# EAGLE design H03 (EAGLE 6.6.0)

## Sheet 1 of 4
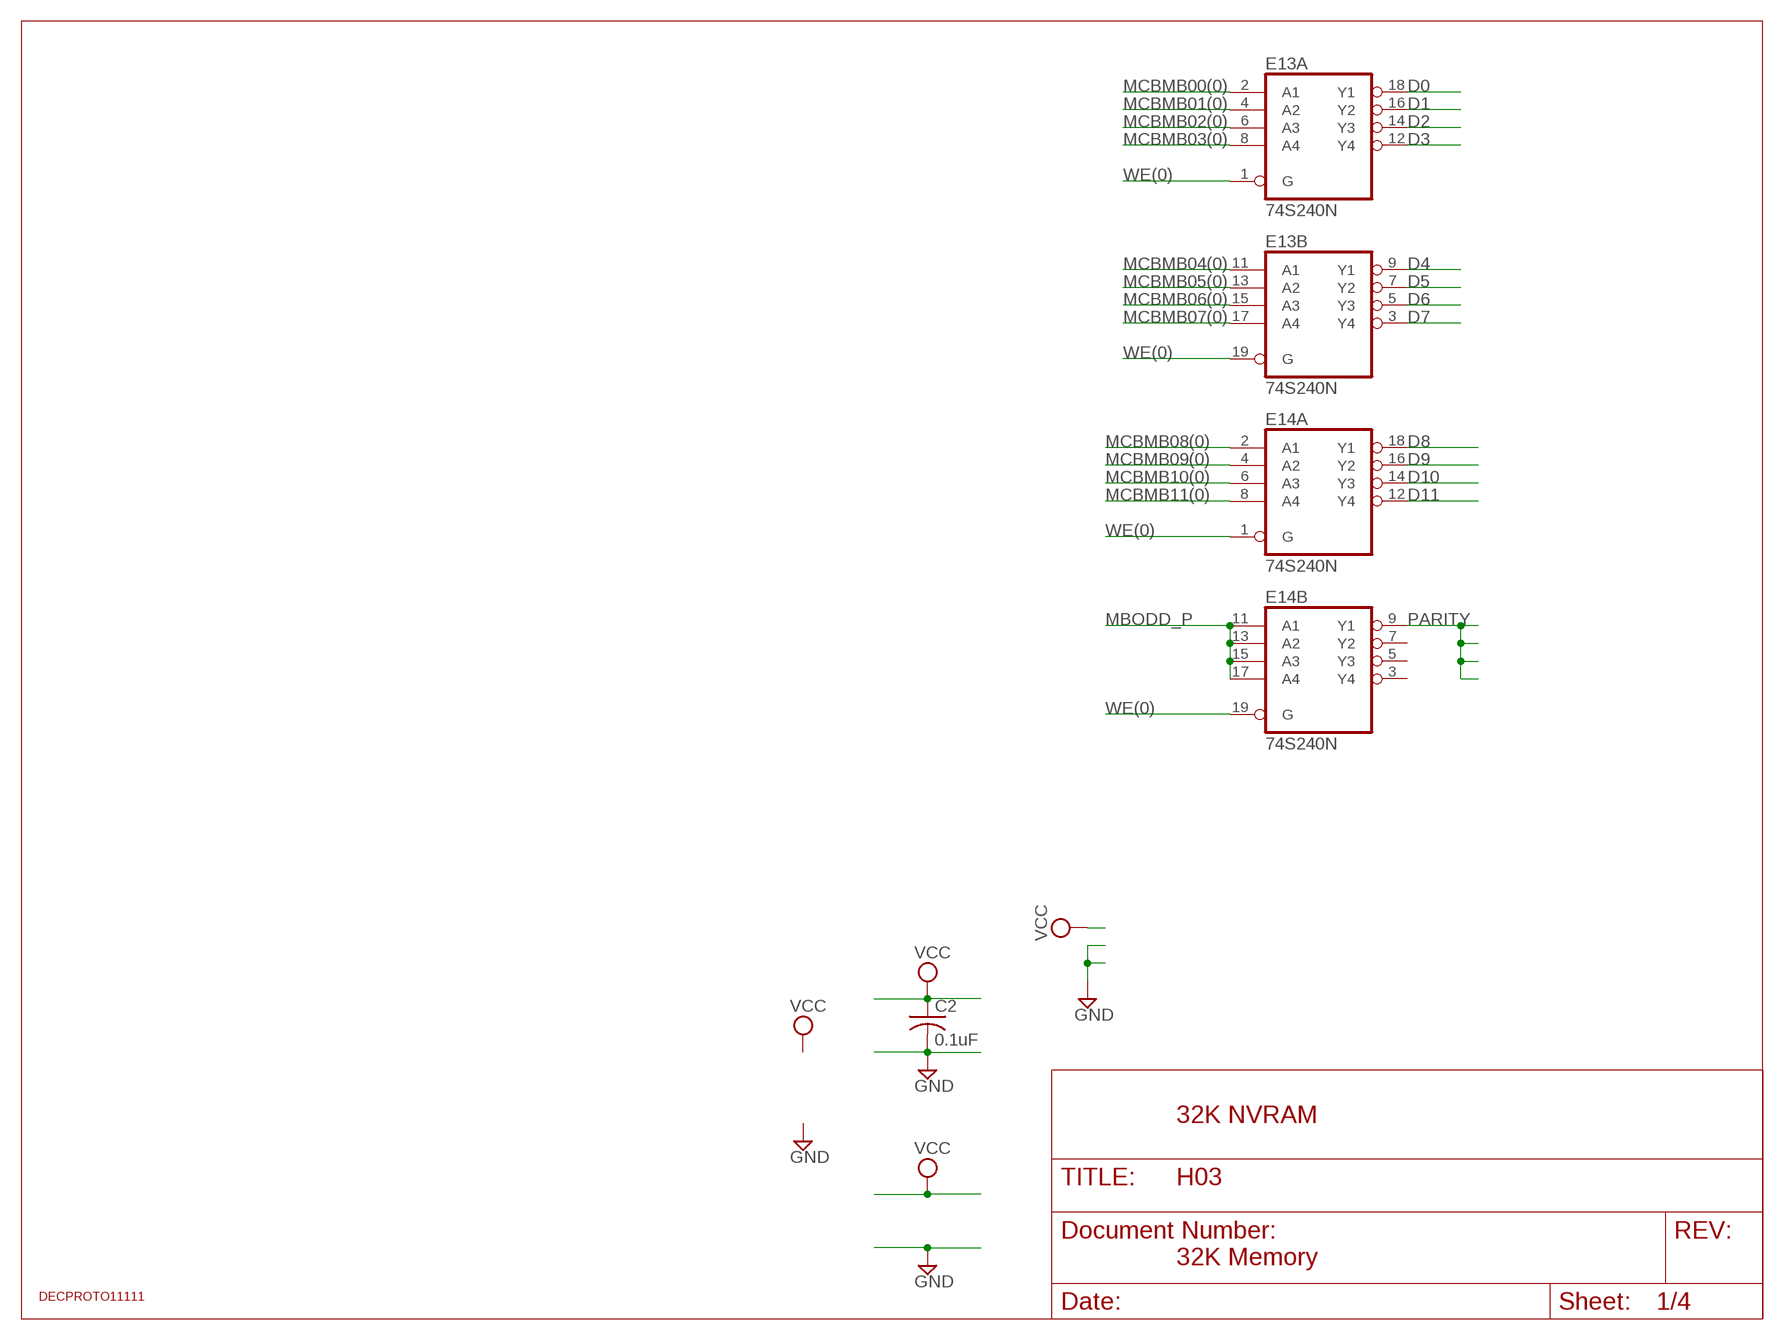
[diagram p0: schematic, sheet 1]

### Parts
C2  0.1uF  C-US050-025X075  [C050-025X075]
E13  74S240N  [DIL20]
E14  74S240N  [DIL20]
U$6  DECPROTO11111  [DECPROTO11111]

### Nets
D0: E13.18(A:Y1) ; also sheet 3
D1: E13.16(A:Y2) ; also sheet 3
D2: E13.14(A:Y3) ; also sheet 3
D3: E13.12(A:Y4) ; also sheet 3
D4: E13.9(B:Y1) ; also sheet 3
D5: E13.7(B:Y2) ; also sheet 3
D6: E13.5(B:Y3) ; also sheet 3
D7: E13.3(B:Y4) ; also sheet 3
D8: E14.18(A:Y1) ; also sheet 3
D9: E14.16(A:Y2) ; also sheet 3
D10: E14.14(A:Y3) ; also sheet 3
D11: E14.12(A:Y4) ; also sheet 3
GND [supply]: C2.2 ; also sheet 2,3
MBODD_P: E14.11(B:A1) E14.13(B:A2) E14.15(B:A3) E14.17(B:A4) ; also sheet 3
MCBMB00(0): E13.2(A:A1) ; also sheet 3
MCBMB01(0): E13.4(A:A2) ; also sheet 3
MCBMB02(0): E13.6(A:A3) ; also sheet 3
MCBMB03(0): E13.8(A:A4) ; also sheet 2
MCBMB04(0): E13.11(B:A1) ; also sheet 2
MCBMB05(0): E13.13(B:A2) ; also sheet 2
MCBMB06(0): E13.15(B:A3) ; also sheet 2
MCBMB07(0): E13.17(B:A4) ; also sheet 2
MCBMB08(0): E14.2(A:A1) ; also sheet 2
MCBMB09(0): E14.4(A:A2) ; also sheet 2
MCBMB10(0): E14.6(A:A3) ; also sheet 2
MCBMB11(0): E14.8(A:A4) ; also sheet 2
PARITY: E14.9(B:Y1) ; also sheet 3
VCC [supply]: C2.1 ; also sheet 2
WE(0): E13.1(A:G) E13.19(B:G) E14.1(A:G) E14.19(B:G) ; also sheet 3
Unconnected: E14.3(B:Y4) E14.5(B:Y3) E14.7(B:Y2)

### Notes on the sheet
- 32K NVRAM
- 32K Memory

## Sheet 2 of 4
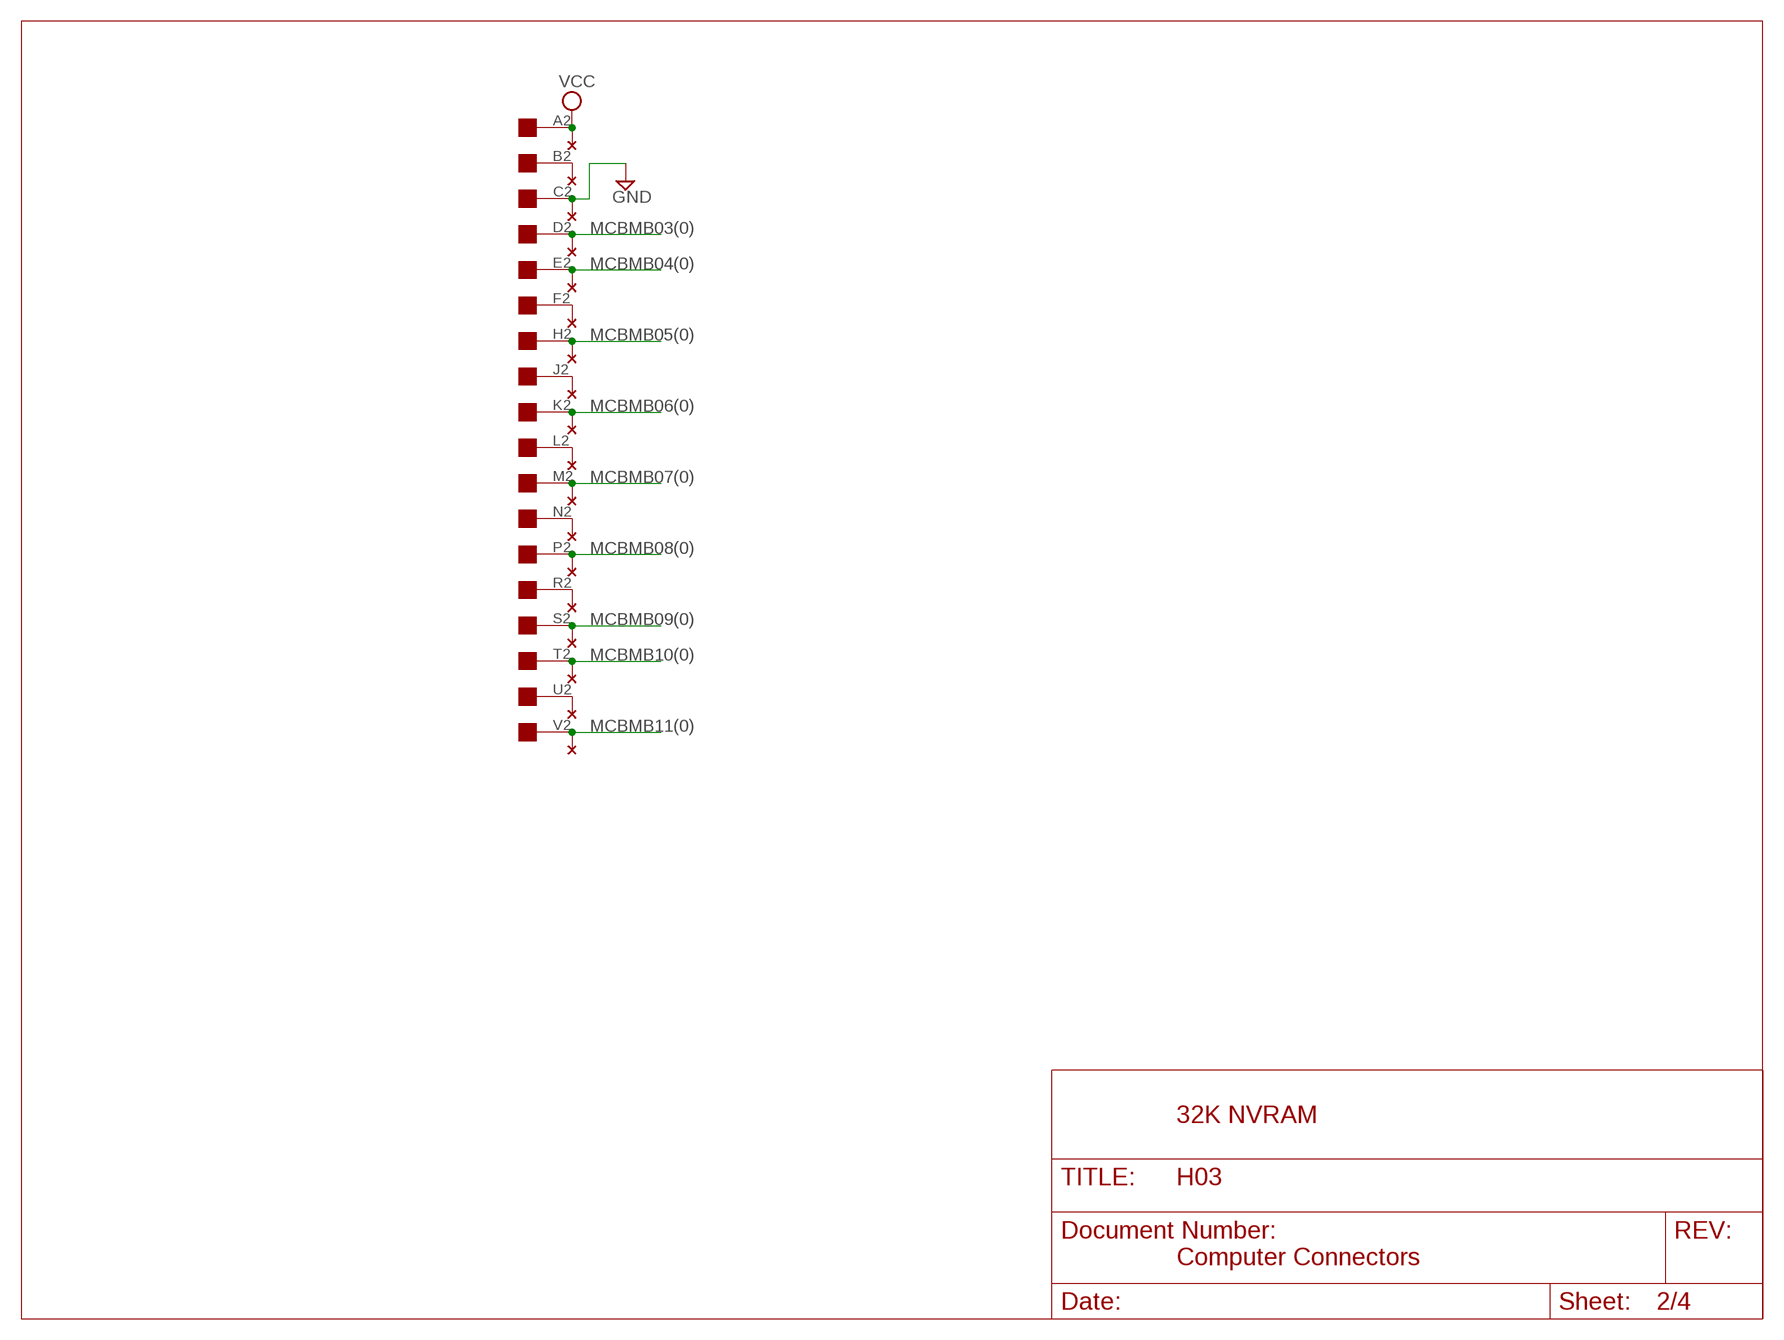
[diagram p1: schematic, sheet 2]

### Parts
H03  EDGE-1  [EDGE-CON1]
U$3  THRU-HOLE2  [THRU-HOLEB]

### Nets
GND [supply]: H03.C2 U$3.C2 ; also sheet 1,3
MCBMB03(0): H03.D2 U$3.D2 ; also sheet 1
MCBMB04(0): H03.E2 U$3.E2 ; also sheet 1
MCBMB05(0): H03.H2 U$3.H2 ; also sheet 1
MCBMB06(0): H03.K2 U$3.K2 ; also sheet 1
MCBMB07(0): H03.M2 U$3.M2 ; also sheet 1
MCBMB08(0): H03.P2 U$3.P2 ; also sheet 1
MCBMB09(0): H03.S2 U$3.S2 ; also sheet 1
MCBMB10(0): H03.T2 U$3.T2 ; also sheet 1
MCBMB11(0): H03.V2 U$3.V2 ; also sheet 1
N$57: H03.J2 U$3.J2
N$58: H03.L2 U$3.L2
N$59: H03.N2 U$3.N2
N$60: H03.F2 U$3.F2
N$61: H03.R2 U$3.R2
N$62: H03.B2 U$3.B2
N$63: H03.U2 U$3.U2
VCC [supply]: H03.A2 U$3.A2 ; also sheet 1
Unconnected: U$3.A1 U$3.B1 U$3.C1 U$3.D1 U$3.E1 U$3.F1 U$3.H1 U$3.J1 U$3.K1 U$3.L1 U$3.M1 U$3.N1 U$3.P1 U$3.R1 U$3.S1 U$3.T1 U$3.U1 U$3.V1

### Notes on the sheet
- 32K NVRAM
- Computer Connectors

## Sheet 3 of 4
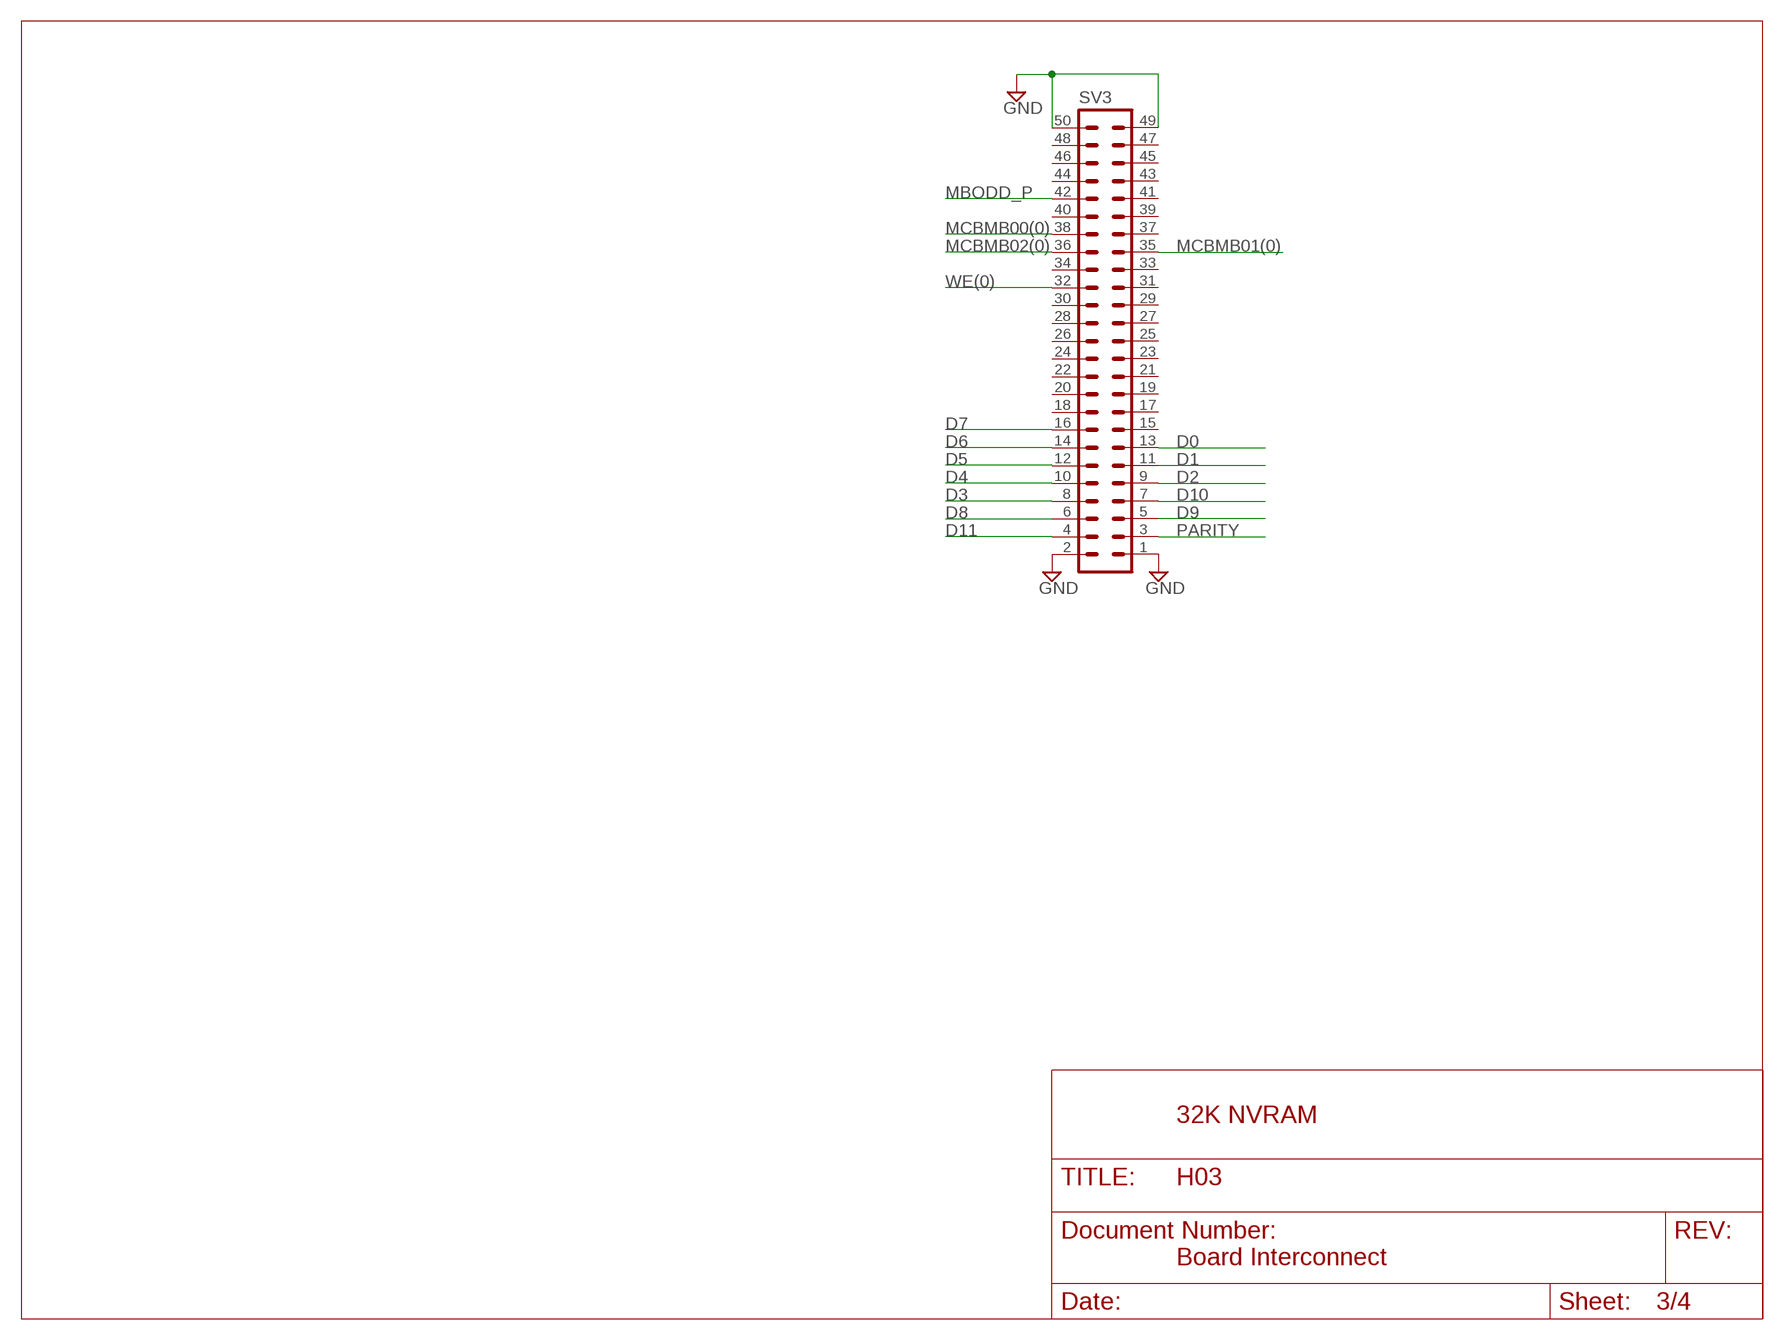
[diagram p2: schematic, sheet 3]

### Parts
SV3  ML50L  [ML50L]

### Nets
D0: SV3.13 ; also sheet 1
D1: SV3.11 ; also sheet 1
D2: SV3.9 ; also sheet 1
D3: SV3.8 ; also sheet 1
D4: SV3.10 ; also sheet 1
D5: SV3.12 ; also sheet 1
D6: SV3.14 ; also sheet 1
D7: SV3.16 ; also sheet 1
D8: SV3.6 ; also sheet 1
D9: SV3.5 ; also sheet 1
D10: SV3.7 ; also sheet 1
D11: SV3.4 ; also sheet 1
GND [supply]: SV3.1 SV3.2 SV3.49 SV3.50 ; also sheet 1,2
MBODD_P: SV3.42 ; also sheet 1
MCBMB00(0): SV3.38 ; also sheet 1
MCBMB01(0): SV3.35 ; also sheet 1
MCBMB02(0): SV3.36 ; also sheet 1
PARITY: SV3.3 ; also sheet 1
WE(0): SV3.32 ; also sheet 1
Unconnected: SV3.15 SV3.17 SV3.18 SV3.19 SV3.20 SV3.21 SV3.22 SV3.23 SV3.24 SV3.25 SV3.26 SV3.27 SV3.28 SV3.29 SV3.30 SV3.31 SV3.33 SV3.34 SV3.37 SV3.39 SV3.40 SV3.41 SV3.43 SV3.44 SV3.45 SV3.46 SV3.47 SV3.48

### Notes on the sheet
- 32K NVRAM
- Board Interconnect

## Sheet 4 of 4
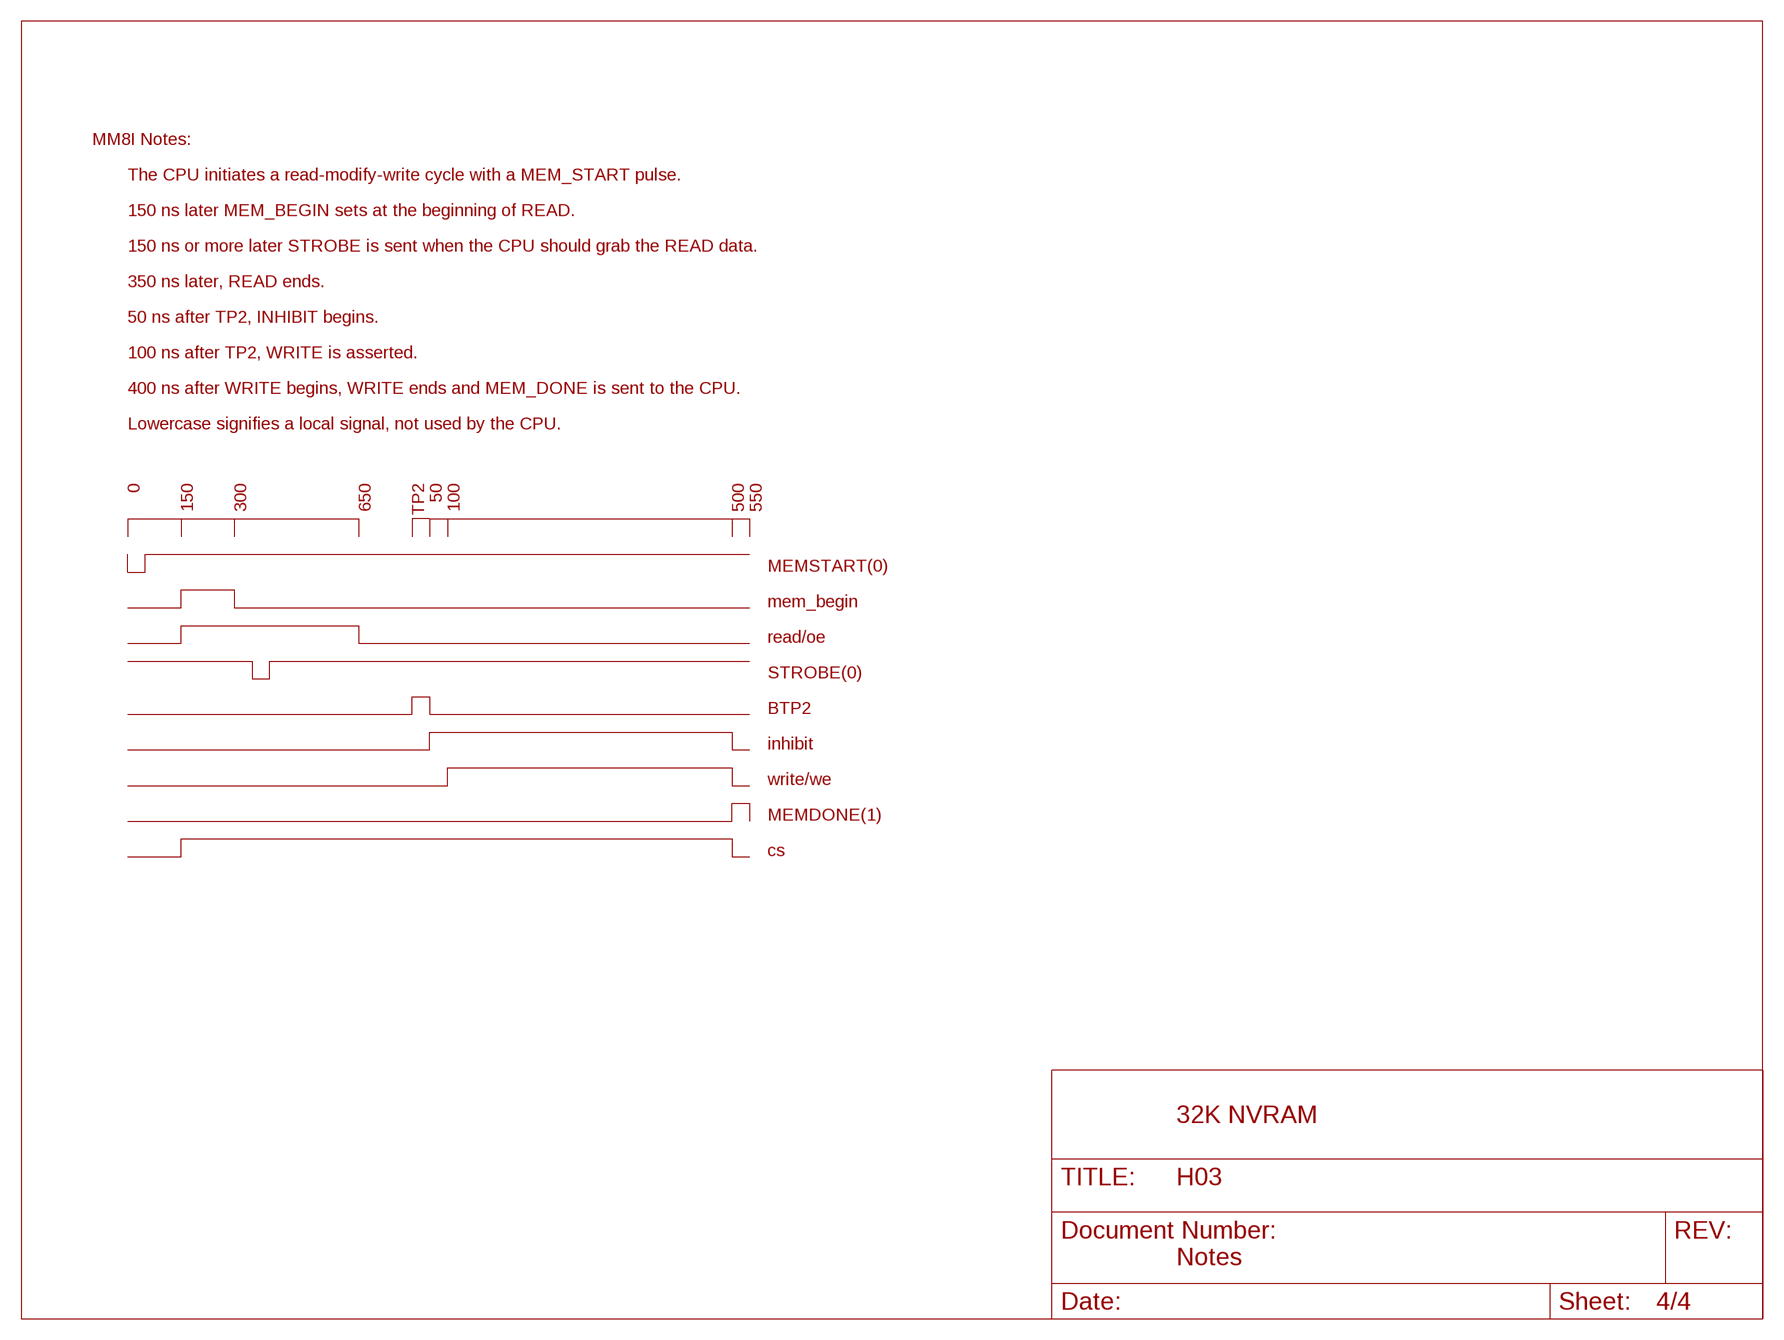
[diagram p3: schematic, sheet 4]

### Notes on the sheet
- MM8I Notes:
- The CPU initiates a read-modify-write cycle with a MEM_START pulse.
- 150 ns later MEM_BEGIN sets at the beginning of READ.
- 150 ns or more later STROBE is sent when the CPU should grab the READ data.
- 350 ns later, READ ends.
- 50 ns after TP2, INHIBIT begins.
- 100 ns after TP2, WRITE is asserted.
- 400 ns after WRITE begins, WRITE ends and MEM_DONE is sent to the CPU.
- Lowercase signifies a local signal, not used by the CPU.
- 0 | 150 | 300 | 650 | TP2 | 50 | 100 | 500 | 550
- MEMSTART(0)
- mem_begin
- read/oe
- STROBE(0)
- BTP2
- inhibit
- write/we
- MEMDONE(1)
- cs
- 32K NVRAM
- Notes

## Power pins joined to a net without a drawn wire
GND: E13.10(P:GND) E14.10(P:GND)
VCC: E13.20(P:VCC) E14.20(P:VCC)

## Library data of the parts
C2 = rcl:C-US: CAPACITOR, American symbol
E13 E14 = 74xx-us:74*240: Octal BUFFER and LINE DRIVER, 3-state
H03 = dec-con:EDGE-1: Single-Sided DEC Edge Connector -- (side 2)
SV3 = con-ml:ML50L: HARTING; OC_FARNELL: unknown; OC_NEWARK: unknown
U$3 = dec-con:THRU-HOLE2: Thru-Hole addition to double-sided edge connector.
U$6 = dec-con:DECPROTO: Various small DEC boards stuck together with break-away tab routing.

## Net classes
1 supply: width 0.711 mm

## Board
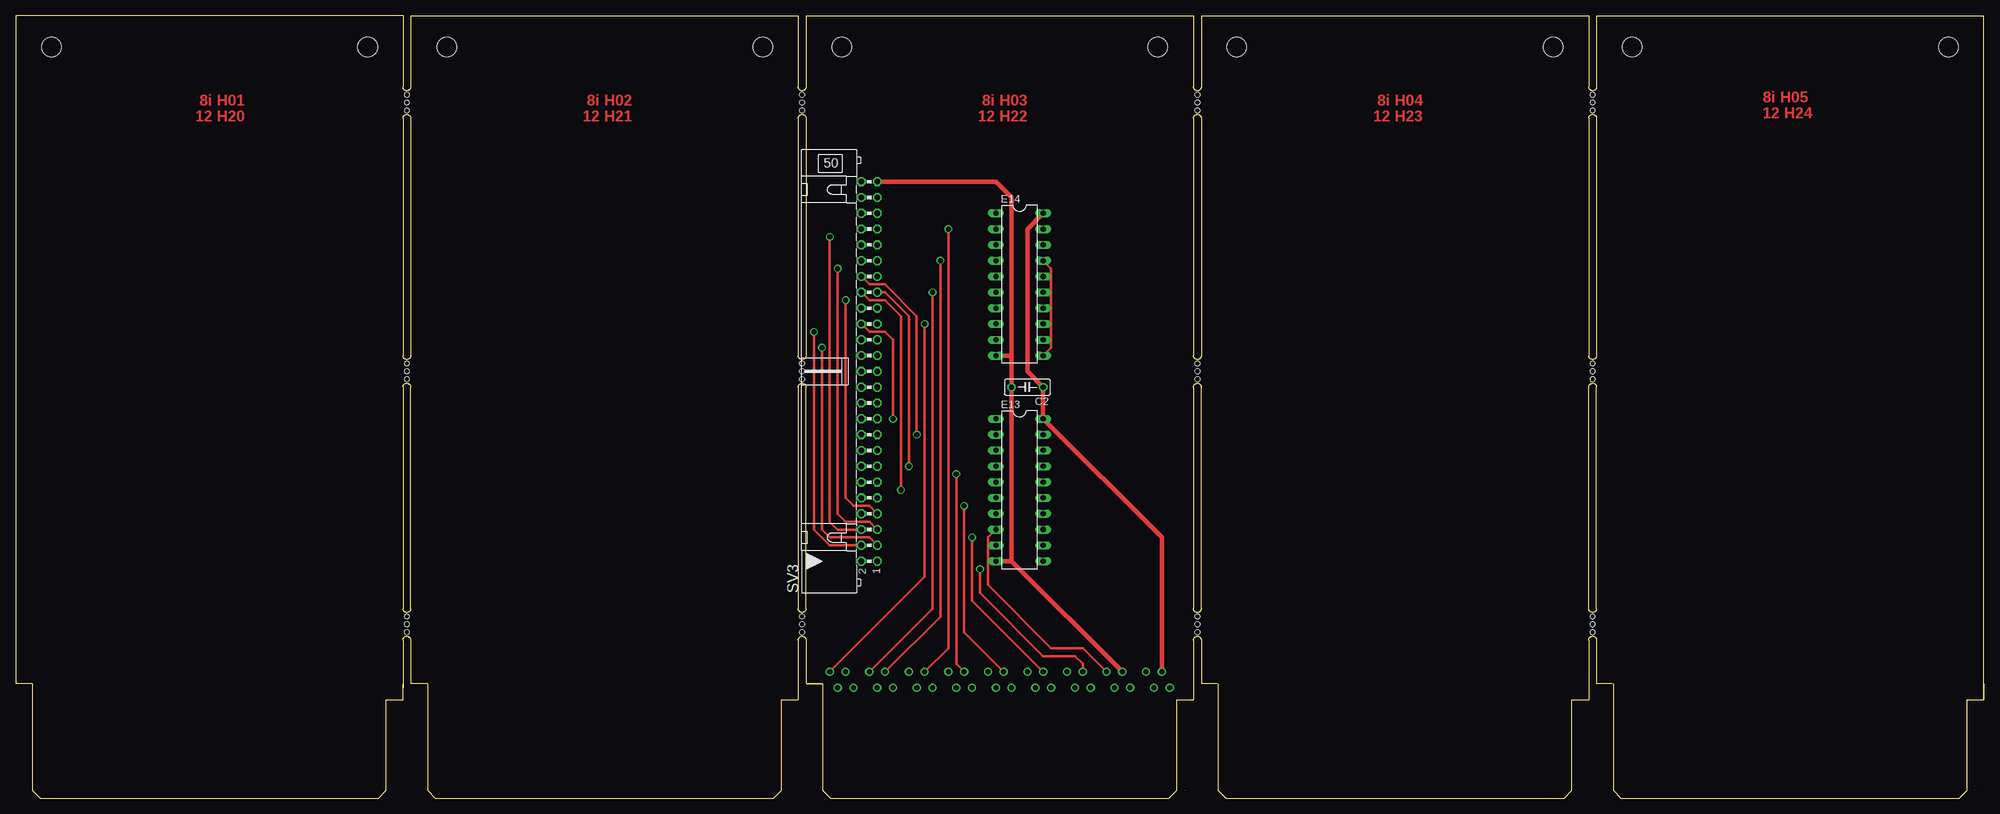
[diagram p4: board, top side]
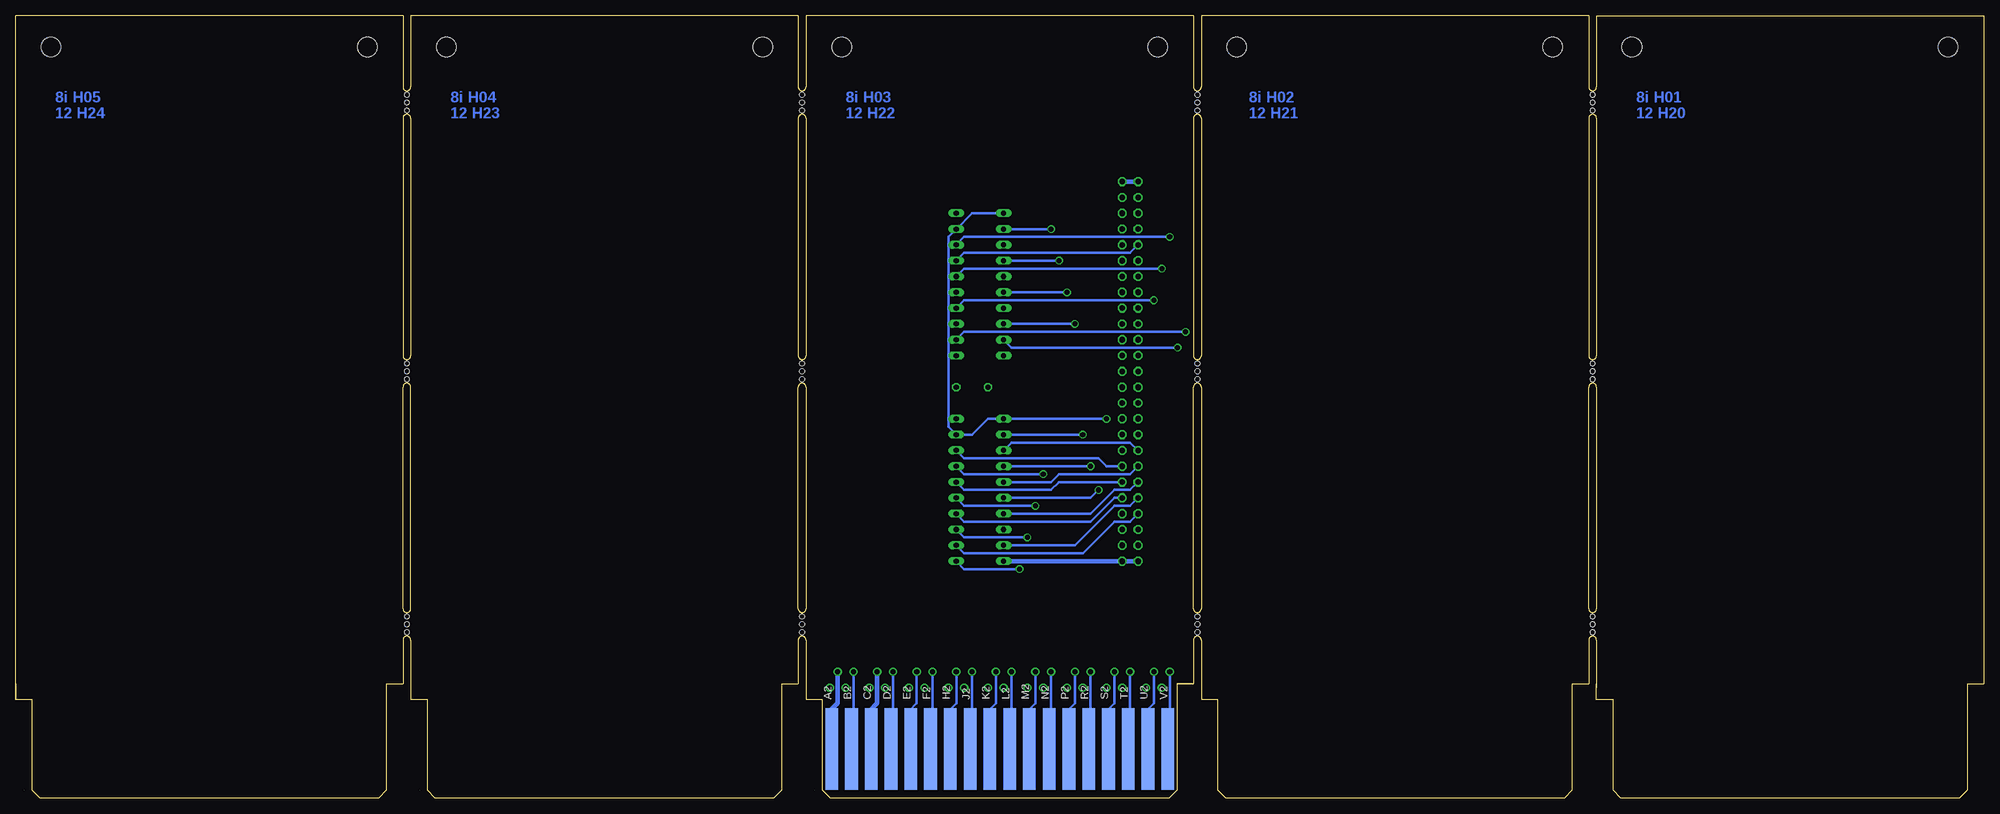
[diagram p5: board, bottom side, seen from below]

Size 316.23 x 125.73 mm. Coordinates in mm from the lower left corner, seen from the top.
Copper layers (1+16): Top 0.035mm / dielectric 1.5mm / Bottom 0.035mm
Design rules "16mils": minimum track width 16mil, minimum drill 32mil, track to track 15mil, track to pad 10mil, pad to pad 10mil, via to via 10mil, smd to smd 10mil, copper to edge 13mil, drill to drill 10mil, minimum pad ring 10mil, minimum via ring 8mil, stop-mask expansion 0mil, vias tented up to drill 0mil, thermal gap 10mil

### Footprints (pad centres in the part's own frame; a part is rotated, then mirrored left to right if it is on the bottom)
C050-025X075 = drill 0.813 octagon: 1 -2.54,0; 2 2.54,0
DIL20 = drill 0.813 long: 1 -11.43,-3.81; 2 -8.89,-3.81; 3 -6.35,-3.81; 4 -3.81,-3.81; 5 -1.27,-3.81; 6 1.27,-3.81; 7 3.81,-3.81; 8 6.35,-3.81; 9 8.89,-3.81; 10 11.43,-3.81; 11 11.43,3.81; 12 8.89,3.81; 13 6.35,3.81; 14 3.81,3.81; 15 1.27,3.81; 16 -1.27,3.81; 17 -3.81,3.81; 18 -6.35,3.81; 19 -8.89,3.81; 20 -11.43,3.81
EDGE-CON1 = smd 13.106 x 2.032 bottom: A2 7.938,4.128; B2 7.938,7.303; C2 7.938,10.477; D2 7.938,13.652; E2 7.938,16.828; F2 7.938,20.003; H2 7.938,23.177; J2 7.938,26.352; K2 7.938,29.527; L2 7.938,32.703; M2 7.938,35.877; N2 7.938,39.053; P2 7.938,42.227; R2 7.938,45.403; S2 7.938,48.578; T2 7.938,51.752; U2 7.938,54.928; V2 7.938,58.102
ML50L = drill 0.914 octagon: 1 -30.48,-1.27; 2 -30.48,1.27; 3 -27.94,-1.27; 4 -27.94,1.27; 5 -25.4,-1.27; 6 -25.4,1.27; 7 -22.86,-1.27; 8 -22.86,1.27; 9 -20.32,-1.27; 10 -20.32,1.27; 11 -17.78,-1.27; 12 -17.78,1.27; 13 -15.24,-1.27; 14 -15.24,1.27; 15 -12.7,-1.27; 16 -12.7,1.27; 17 -10.16,-1.27; 18 -10.16,1.27; 19 -7.62,-1.27; 20 -7.62,1.27; 21 -5.08,-1.27; 22 -5.08,1.27; 23 -2.54,-1.27; 24 -2.54,1.27; 25 0,-1.27; 26 0,1.27; 27 2.54,-1.27; 28 2.54,1.27; 29 5.08,-1.27; 30 5.08,1.27; 31 7.62,-1.27; 32 7.62,1.27; 33 10.16,-1.27; 34 10.16,1.27; 35 12.7,-1.27; 36 12.7,1.27; 37 15.24,-1.27; 38 15.24,1.27; 39 17.78,-1.27; 40 17.78,1.27; 41 20.32,-1.27; 42 20.32,1.27; 43 22.86,-1.27; 44 22.86,1.27; 45 25.4,-1.27; 46 25.4,1.27; 47 27.94,-1.27; 48 27.94,1.27; 49 30.48,-1.27; 50 30.48,1.27
THRU-HOLEB = drill 0.813 pad 1.27: A1 17.78,3.81; A2 20.32,5.08; B1 17.78,6.35; B2 20.32,7.62; C1 17.78,10.16; C2 20.32,11.43; D1 17.78,12.7; D2 20.32,13.97; E1 17.78,16.51; E2 20.32,17.78; F1 17.78,19.05; F2 20.32,20.32; H1 17.78,22.86; H2 20.32,24.13; J1 17.78,25.4; J2 20.32,26.67; K1 17.78,29.21; K2 20.32,30.48; L1 17.78,31.75; L2 20.32,33.02; M1 17.78,35.56; M2 20.32,36.83; N1 17.78,38.1; N2 20.32,39.37; P1 17.78,41.91; P2 20.32,43.18; R1 17.78,44.45; R2 20.32,45.72; S1 17.78,48.26; S2 20.32,49.53; T1 17.78,50.8; T2 20.32,52.07; U1 17.78,54.61; U2 20.32,55.88; V1 17.78,57.15; V2 20.32,58.42
DECPROTO11111 = hole 3.175: 183.515,120.65; 132.715,120.65; 69.266,120.65; 120.066,120.65; 56.566,120.65; 5.766,120.65; 247.015,120.65; 196.215,120.65; 310.515,120.65; 259.715,120.65 | hole 0.813: 62.865,69.85; 62.865,68.58; 62.865,67.31; 62.865,26.67; 62.865,27.94; 62.865,29.21; 62.865,113.03; 62.865,110.49; 62.865,111.76; 126.365,69.85; 126.365,68.58; 126.365,67.31; 126.365,26.67; 126.365,27.94; 126.365,29.21; 126.365,113.03; 126.365,110.49; 126.365,111.76; 189.865,26.67; 189.865,27.94; 189.865,29.21; 189.865,67.31; 189.865,68.58; 189.865,69.85; 189.865,110.49; 189.865,111.76; 189.865,113.03; 253.365,26.67; 253.365,27.94; 253.365,29.21; 253.365,67.31; 253.365,68.58; 253.365,69.85; 253.365,110.49; 253.365,111.76; 253.365,113.03

### Placement (x,y rotation side)
C2  162.56,66.04 180 top
E13  161.29,49.53 270 top
E14  161.29,82.55 270 top
H03  189.23,0 90 top
SV3  137.16,68.58 90 top
U$3  189.23,0 90 top
U$6  0,0 0 top

### Tracks (layer width: path | path; a pad name or v marks a point on that pad's centre or on a via)
D0
  Bottom 0.406: SV3.13 140.97,53.34 142.24,54.61 163.83,54.61 E13.18
D1
  Bottom 0.406: SV3.11 148.59,50.8 149.86,49.53 163.83,49.53 E13.16
D2
  Bottom 0.406: SV3.9 139.7,48.26 143.51,44.45 163.83,44.45 E13.14
D3
  Bottom 0.406: E13.12 163.83,39.37 144.78,39.37 139.7,44.45 137.16,44.45 SV3.8
D4
  Bottom 0.406: E13.9 146.05,40.64 139.7,46.99 137.16,46.99 SV3.10
D5
  Bottom 0.406: SV3.12 137.16,49.53 139.7,49.53 143.51,45.72 E13.7
D6
  Bottom 0.406: SV3.14 137.16,52.07 148.59,52.07 149.86,50.8 E13.5
D7
  Bottom 0.406: SV3.16 137.16,57.15 156.21,57.15 E13.3
D8  (via drill 0.81)
  Top 0.406: SV3.6 132.08,43.18 130.81,44.45 v130.81,90.17
  Bottom 0.406: E14.18 163.83,90.17 v130.81,90.17
D9  (via drill 0.81)
  Top 0.406: SV3.5 137.16,44.45 133.35,44.45 132.08,45.72 v132.08,85.09
  Bottom 0.406: E14.16 163.83,85.09 v132.08,85.09
D10  (via drill 0.81)
  Top 0.406: SV3.7 137.16,46.99 134.62,46.99 133.35,48.26 v133.35,80.01
  Bottom 0.406: E14.14 163.83,80.01 v133.35,80.01
D11  (via drill 0.81)
  Top 0.406: SV3.4 130.81,40.64 128.27,43.18 v128.27,74.93
  Bottom 0.406: E14.12 163.83,74.93 v128.27,74.93
GND
  Top 0.711: 160.02,38.1 C2.2 160.02,71.12 | E14.10 160.02,71.12 | SV3.49 157.48,99.06 160.02,96.52 160.02,71.12 | E13.10 160.02,38.1 | 160.02,38.1 U$3.C2
  Bottom 0.711: H03.C2 178.75,8.57 179.07,8.89 179.07,13.97 177.8,15.24 U$3.C2 | SV3.2 SV3.1 E13.10 | SV3.50 SV3.49
MBODD_P
  Top 0.406: E14.11 166.37,72.39 166.37,76.2 | 166.37,76.2 166.37,81.28 | 166.37,81.28 166.37,85.09 E14.17 | E14.15 166.37,81.28 | E14.13 166.37,76.2
  Bottom 0.406: SV3.42 137.16,87.63 163.83,87.63 E14.17
MCBMB00(0)  (via drill 0.81)
  Top 0.406: SV3.38 137.16,82.55 139.7,82.55 144.78,77.47 v144.78,58.42
  Bottom 0.406: v144.78,58.42 E13.2
MCBMB01(0)  (via drill 0.81)
  Top 0.406: SV3.35 139.7,81.28 143.51,77.47 v143.51,53.34
  Bottom 0.406: v143.51,53.34 E13.4
MCBMB02(0)  (via drill 0.81)
  Top 0.406: SV3.36 137.16,80.01 139.7,80.01 142.24,77.47 v142.24,49.53
  Bottom 0.406: E13.6 143.51,48.26 v142.24,49.53
MCBMB03(0)
  Top 0.406: U$3.D2 171.45,24.13 166.37,24.13 156.21,34.29 156.21,41.91 E13.8
  Bottom 0.406: H03.D2 175.58,8.57 175.26,8.89 U$3.D2
MCBMB04(0)  (via drill 0.81)
  Top 0.406: U$3.E2 171.45,21.59 170.18,22.86 165.1,22.86 154.94,33.02 v154.94,36.83
  Bottom 0.406: H03.E2 172.4,8.57 172.72,8.89 172.72,13.97 171.45,15.24 U$3.E2 | v154.94,36.83 163.83,36.83 E13.11
MCBMB05(0)  (via drill 0.81)
  Top 0.406: U$3.H2 153.67,31.75 v153.67,41.91
  Bottom 0.406: H03.H2 166.05,8.57 166.37,8.89 166.37,13.97 165.1,15.24 U$3.H2 | v153.67,41.91 163.83,41.91 E13.13
MCBMB06(0)  (via drill 0.81)
  Top 0.406: U$3.K2 152.4,26.67 v152.4,46.99
  Bottom 0.406: H03.K2 159.7,8.57 160.02,8.89 160.02,13.97 158.75,15.24 U$3.K2 | v152.4,46.99 163.83,46.99 E13.15
MCBMB07(0)  (via drill 0.81)
  Top 0.406: U$3.M2 151.13,21.59 v151.13,52.07
  Bottom 0.406: H03.M2 153.35,8.57 153.67,8.89 153.67,13.97 152.4,15.24 U$3.M2 | v151.13,52.07 163.83,52.07 E13.17
MCBMB08(0)  (via drill 0.81)
  Top 0.406: U$3.P2 149.86,24.13 v149.86,91.44
  Bottom 0.406: H03.P2 147,8.57 147.32,8.89 147.32,13.97 146.05,15.24 U$3.P2 | v149.86,91.44 E14.2
MCBMB09(0)  (via drill 0.81)
  Top 0.406: U$3.S2 148.59,29.21 v148.59,86.36
  Bottom 0.406: H03.S2 140.65,8.57 140.97,8.89 140.97,13.97 139.7,15.24 U$3.S2 | v148.59,86.36 E14.4
MCBMB10(0)  (via drill 0.81)
  Top 0.406: U$3.T2 147.32,30.48 v147.32,81.28
  Bottom 0.406: H03.T2 137.16,7.62 U$3.T2 | v147.32,81.28 E14.6
MCBMB11(0)  (via drill 0.81)
  Top 0.406: U$3.V2 146.05,35.56 v146.05,76.2
  Bottom 0.406: H03.V2 131.13,8.57 130.81,8.89 U$3.V2 | v146.05,76.2 E14.8
N$57
  Bottom 0.406: H03.J2 162.88,8.57 162.56,8.89 U$3.J2
N$58
  Bottom 0.406: H03.L2 156.53,8.57 156.21,8.89 U$3.L2
N$59
  Bottom 0.406: H03.N2 150.18,8.57 149.86,8.89 U$3.N2
N$60
  Bottom 0.406: H03.F2 169.23,8.57 168.91,8.89 U$3.F2
N$61
  Bottom 0.406: H03.R2 143.83,8.57 143.51,8.89 U$3.R2
N$62
  Bottom 0.406: H03.B2 181.93,8.57 181.61,8.89 U$3.B2
N$63
  Bottom 0.406: H03.U2 134.3,8.57 134.62,8.89 134.62,13.97 133.35,15.24 U$3.U2
PARITY  (via drill 0.81)
  Top 0.406: SV3.3 137.16,41.91 130.81,41.91 129.54,43.18 v129.54,72.39
  Bottom 0.406: E14.9 156.21,72.39 v129.54,72.39
VCC
  Top 0.711: E14.20 162.56,91.44 162.56,68.58 C2.1 E13.20 184.15,41.91 U$3.A2
  Bottom 0.711: H03.A2 185.1,8.57 185.42,8.89 185.42,13.97 184.15,15.24 U$3.A2
WE(0)  (via drill 0.81)
  Top 0.406: SV3.32 137.16,74.93 139.7,74.93 140.97,73.66 v140.97,60.96
  Bottom 0.406: E14.1 162.56,93.98 E14.19 166.37,90.17 166.37,59.69 E13.19 162.56,58.42 160.02,60.96 E13.1 v140.97,60.96

### Text on the board
Top: 8i H01 | 8i H02 | 8i H03 | 8i H04 | 8i H05 | 12 H20 | 12 H21 | 12 H22 | 12 H23 | 12 H24
Bottom: 8i H01 | 8i H02 | 8i H03 | 8i H04 | 8i H05 | 12 H20 | 12 H21 | 12 H22 | 12 H23 | 12 H24
tValues: 8i H01 | 8i H02 | 8i H03 | 8i H04 | 8i H05 | 12 H20 | 12 H21 | 12 H22 | 12 H23 | 12 H24